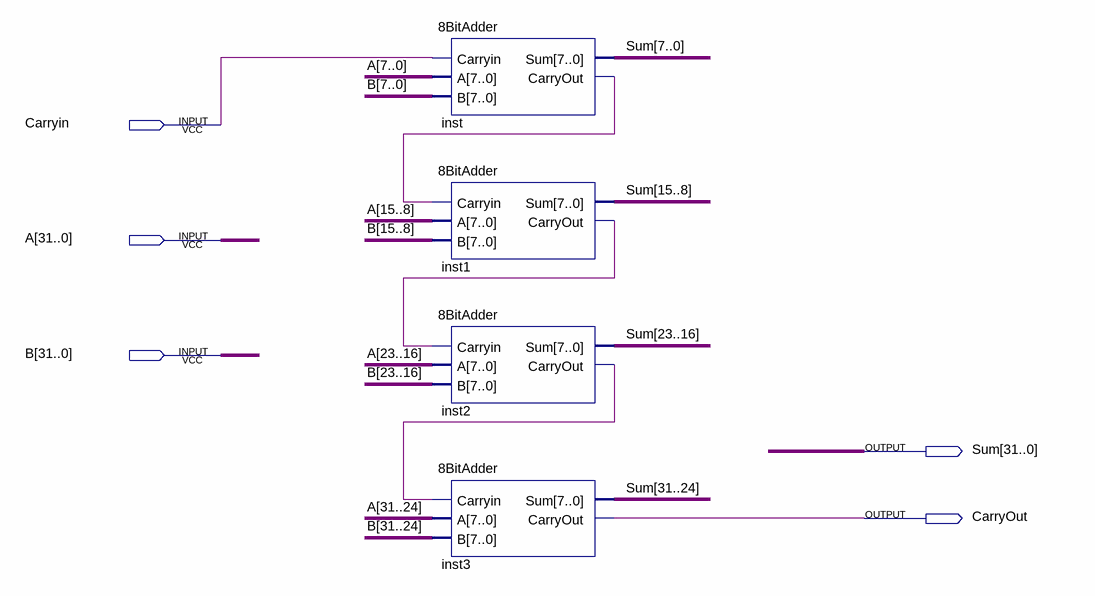
[diagram p0: schematic sheet]
// Quartus schematic 32BitAdder.bdf as structural Verilog: 4 symbols, 5 pins
module \32BitAdder  (
  input  Carryin,
  input  [31:0] A,
  input  [31:0] B,
  output [31:0] Sum,
  output CarryOut
);

  wire inst1_carryout, inst2_carryout, inst_carryout;

  \8BitAdder  inst (.Carryin(Carryin), .A(A[7:0]), .B(B[7:0]), .Sum(Sum[7:0]), .CarryOut(inst_carryout));
  \8BitAdder  inst1 (.Carryin(inst_carryout), .A(A[15:8]), .B(B[15:8]), .Sum(Sum[15:8]), .CarryOut(inst1_carryout));
  \8BitAdder  inst2 (.Carryin(inst1_carryout), .A(A[23:16]), .B(B[23:16]), .Sum(Sum[23:16]), .CarryOut(inst2_carryout));
  \8BitAdder  inst3 (.Carryin(inst2_carryout), .A(A[31:24]), .B(B[31:24]), .Sum(Sum[31:24]), .CarryOut(CarryOut));
endmodule
